# EasyEDA schematic SCH_LD_project_2022-11-01.json
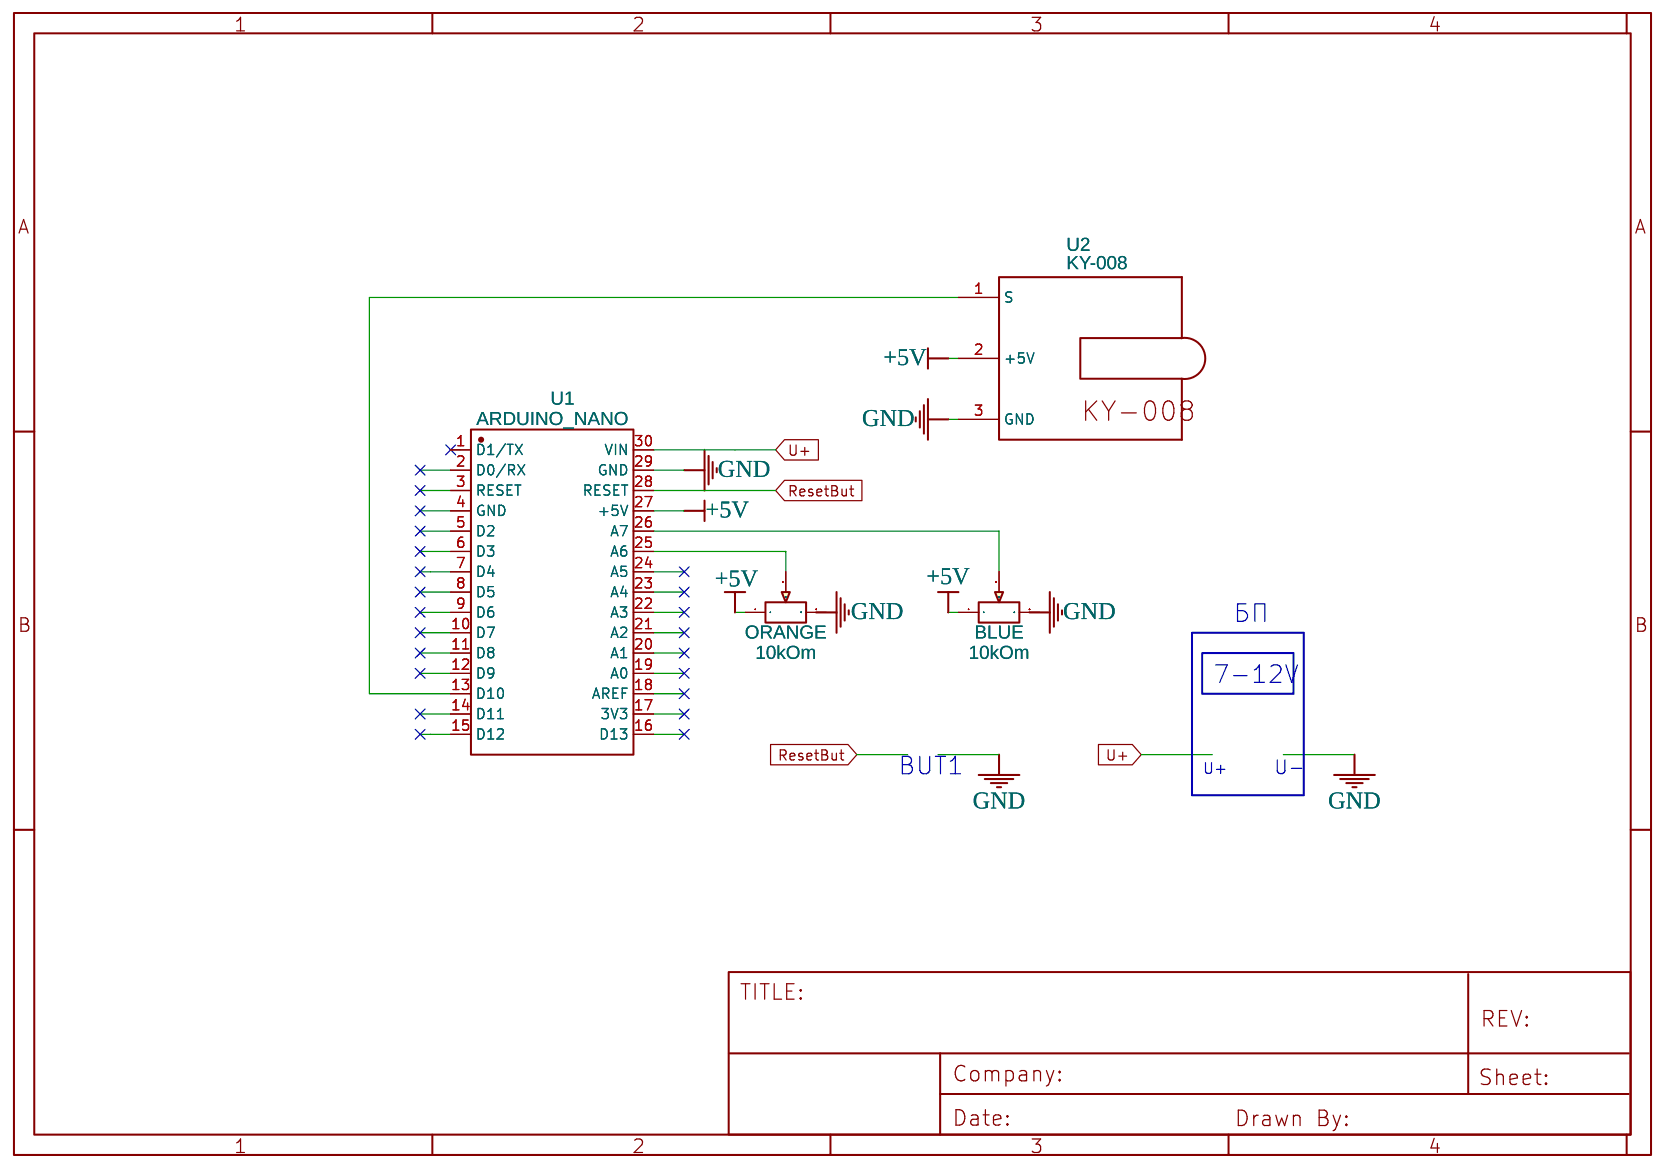
[diagram p0: schematic sheet]

## Parts
BLUE  10kOm  [RES-ADJ-TH_3386P]
ORANGE  10kOm  [RES-ADJ-TH_3386P]
U1  ARDUINO_NANO  [COMM-TH_ARDUINO_NANO]
U2  KY-008  [KY-008 HP]

## Library data of the parts
BLUE ORANGE = R_3386P_EU: Supplier: LCSC; Contributor: LCEDA_Lib; Value(Ω): 10K
U1 = ARDUINO_NANO: Supplier: LCSC; Supplier Part: C9900017879; Manufacturer: null; JLCPCB Part Class: Extended Part; Contributor: lcsc
U2 = KY-008: Contributor: aidar.aliullov22

## Nets
+5V: BLUE.1 ORANGE.1 U1.27(+5V) U2.2(+5V)
GND: BLUE.3 ORANGE.3 U1.29(GND) U2.3(GND)
ResetBut: U1.28(RESET)
U+: U1.30(VIN)
Net-(BLUE-2): BLUE.2 U1.26(A7)
Net-(ORANGE-2): ORANGE.2 U1.25(A6)
Net-(U1-13): U1.13(D10) U2.1(S)

Not connected (* = marked no-connect by the designer): U1 1(D1/TX)* 2(D0/RX) 3(RESET) 4(GND) 5(D2) 6(D3) 7(D4) 8(D5) 9(D6) 10(D7) 11(D8) 12(D9) 14(D11) 15(D12) 16(D13) 17(3V3) 18(AREF) 19(A0) 20(A1) 21(A2) 22(A3) 23(A4) 24(A5)

## Notes on the sheet
- БП
- 7-12V
- BUT1
- U+
- U-
